# Altium schematic sheet Industrial Instrumentation Controller.SchDoc
size A; SheetNumber: 1; SheetTotal: 7
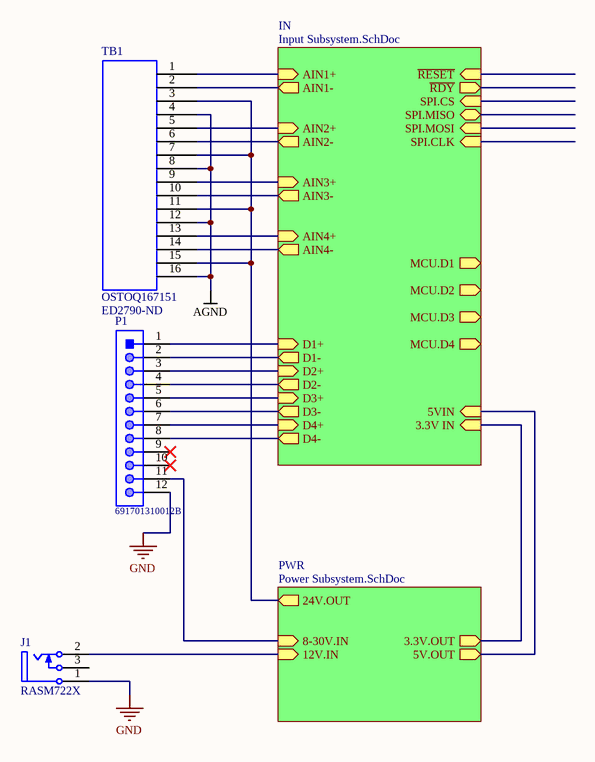
[diagram p0: Industrial Instrumentation Controller.SchDoc]

## Parts
J1  RASM722X  [SWIT-RASM722X_V]
P1  691701310012B  [691701310012B]
TB1  OSTOQ167151  Supplier Part Number 1: ED2790-ND  [OSTOQ167151]

## Sub-sheets
IN = Input Subsystem.SchDoc: SPI.CLK (in), SPI.MOSI (in), SPI.MISO (bidir), SPI.CS (in), ~{RDY} (out), ~{RESET} (in), 3.3V IN (in), AIN1+ (in), AIN1- (out), AIN2+ (in), AIN2- (out), AIN3+ (in), AIN3- (out), AIN4+ (in), AIN4- (out), 5VIN (in), D1+ (in), D2+ (in), D3+ (in), D4+ (in), MCU.D1 (out), MCU.D2 (out), MCU.D3 (out), MCU.D4 (out), D1- (out), D2- (out), D3- (out), D4- (out)
PWR = Power Subsystem.SchDoc: 12V.IN (in), 8-30V.IN (in), 5V.OUT (out), 3.3V.OUT (out), 24V.OUT (out)

## Nets
AGND: TB1.4 TB1.8 TB1.12 TB1.16
GND: J1.1(SLEEVE) P1.12
NetJ1_2: J1.2(TIP) ; sheet PWR/12V.IN
NetP1_1: P1.1 ; sheet IN/D1+
NetP1_2: P1.2 ; sheet IN/D1-
NetP1_3: P1.3 ; sheet IN/D2+
NetP1_4: P1.4 ; sheet IN/D2-
NetP1_5: P1.5 ; sheet IN/D3+
NetP1_6: P1.6 ; sheet IN/D3-
NetP1_7: P1.7 ; sheet IN/D4+
NetP1_8: P1.8 ; sheet IN/D4-
NetP1_11: P1.11 ; sheet PWR/8-30V.IN
NetTB1_1: TB1.1 ; sheet IN/AIN1+
NetTB1_2: TB1.2 ; sheet IN/AIN1-
NetTB1_3: TB1.3 TB1.7 TB1.11 TB1.15 ; sheet PWR/24V.OUT
NetTB1_5: TB1.5 ; sheet IN/AIN2+
NetTB1_6: TB1.6 ; sheet IN/AIN2-
NetTB1_9: TB1.9 ; sheet IN/AIN3+
NetTB1_10: TB1.10 ; sheet IN/AIN3-
NetTB1_13: TB1.13 ; sheet IN/AIN4+
NetTB1_14: TB1.14 ; sheet IN/AIN4-
(unnamed): sheet IN/3.3V IN, sheet PWR/3.3V.OUT
(unnamed): sheet IN/5VIN, sheet PWR/5V.OUT

Not connected (* = marked no-connect by the designer): J1 3(SHUNT); P1 9* 10*

## Library data of the parts
J1 = CMP-1772-00002-1: Power Jack, 5 A, 250 V, 3-Pin SMD, RoHS, Bulk; ComponentLink1URL: http://www.switchcraft.com/; ComponentLink2URL: http://www.switchcraft.com/Drawings/rasm732x_cd.pdf; ComponentLink1Description: Manufacturer URL; PackageReference: RASM722X; ComponentLink2Description: Datasheet; DatasheetVersion: Rev. A, 09/2005; PackageDescription: 3-Pin Surface Mount Device, Body 14.5 x 9 mm
P1 = CMP-1502-01991-1: Serie 7013 B - 3.81mm Vertical PCB Header THR Type WR-TBL, 12 pin; Manufacturer: Wurth Elektronik; Gender: Male; Pin Number: 12; Mounting Technology: SMT; Publisher: WurthElektronik; Operating Temperature: -40to105degC; Pitch: 3.81mm; Package Reference: 691701310012B; Packaging: Box; Manufacturer URL: http://www.we-online.de; Datasheet URL: http://katalog.we-online.de/em/datasheet/6917013100xxB.pdf; Part Number: 691701310012B
TB1 = OSTOQ167151: Supplier 1: Digi-Key